# EasyEDA schematic SCH_HVACMon2_2024-07-10.json
TITLE: HVAC Monitor; REV: 2.0; Date: 2024-06-05; Sheet: 1/1; Drawn By: Chris Smith; Company: Your Company
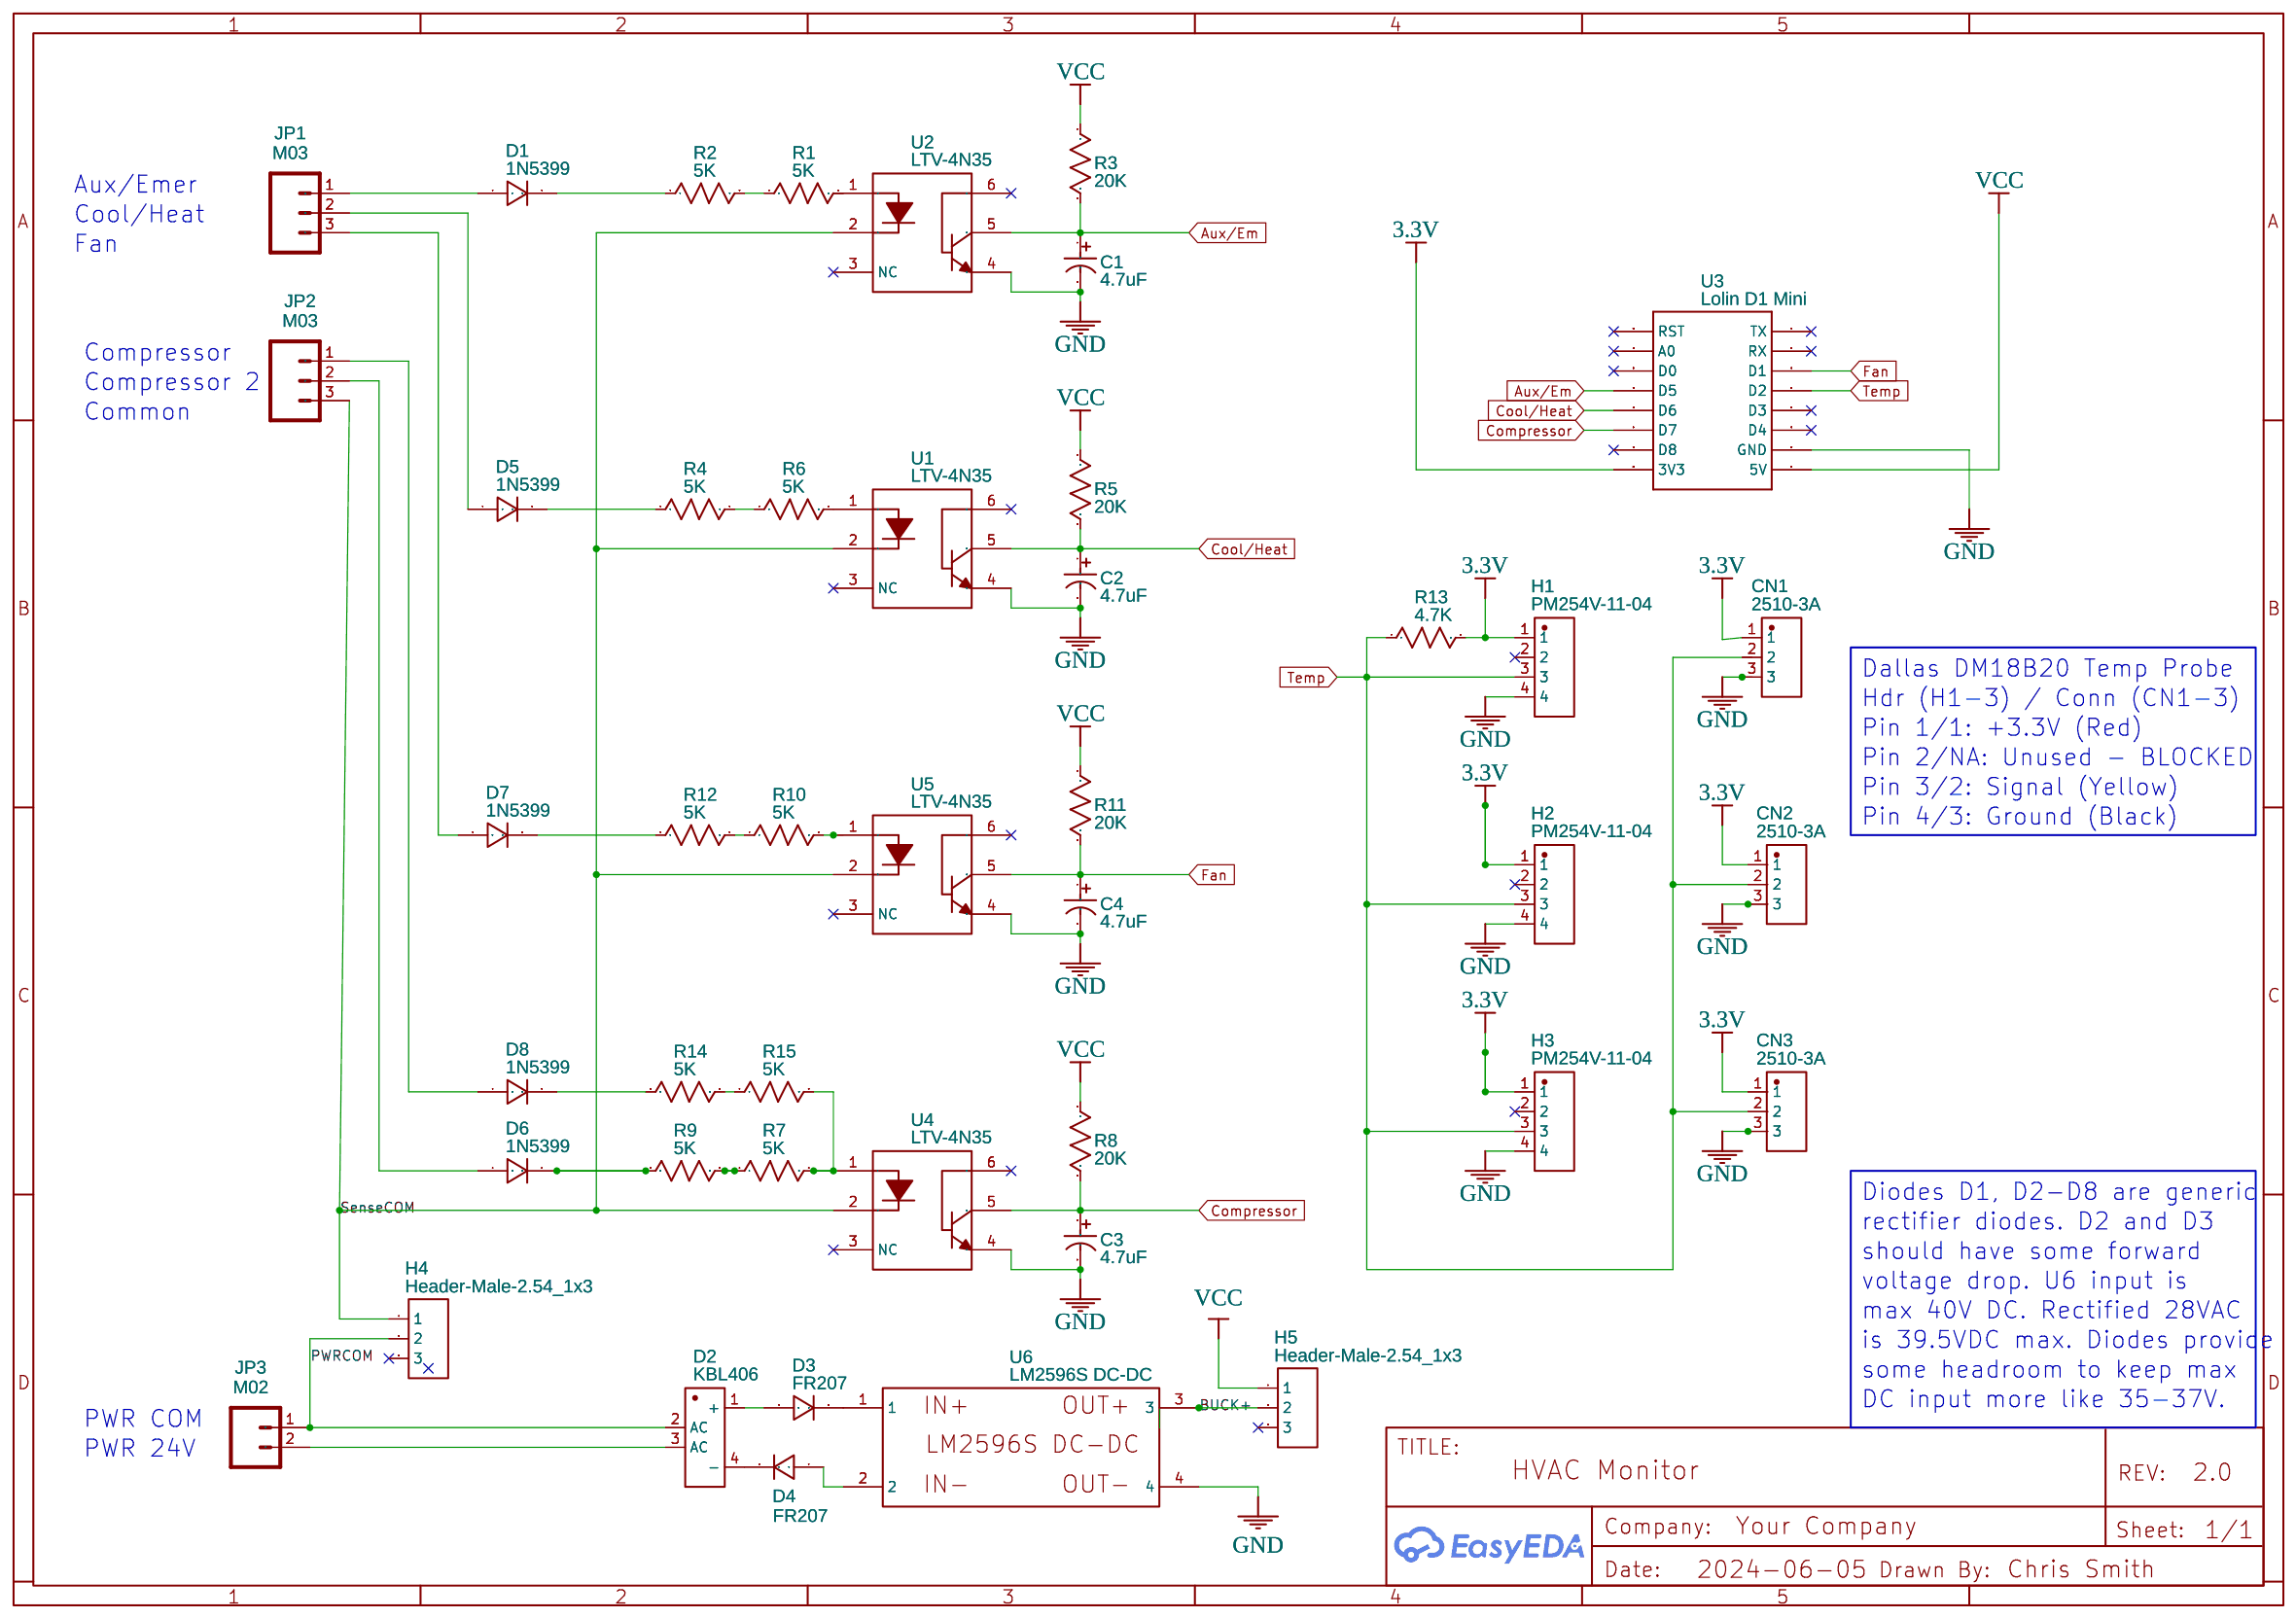
[diagram p0: schematic sheet]

## Parts
C1  4.7uF  [CAP-TH_BD4.0-P1.50-D0.8-FD]
C2  4.7uF  [CAP-TH_BD4.0-P1.50-D0.8-FD]
C3  4.7uF  [CAP-TH_BD4.0-P1.50-D0.8-FD]
C4  4.7uF  [CAP-TH_BD4.0-P1.50-D0.8-FD]
CN1  2510-3A  [CONN-TH_3P-P2.54_CAX_2510-3A]
CN2  2510-3A  [CONN-TH_3P-P2.54_CAX_2510-3A]
CN3  2510-3A  [CONN-TH_3P-P2.54_CAX_2510-3A]
D1  1N5399  [DIODE_DO41]
D2  KBL406  [DIO-BG-TH_KBL406]
D3  FR207  [DIODE_DO41]
D4  FR207  [DIODE_DO41]
D5  1N5399  [DIODE_DO41]
D6  1N5399  [DIODE_DO41]
D7  1N5399  [DIODE_DO41]
D8  1N5399  [DIODE_DO41]
H1  PM254V-11-04  [HDR-TH_4P-P2.54-V-F]
H2  PM254V-11-04  [HDR-TH_4P-P2.54-V-F]
H3  PM254V-11-04  [HDR-TH_4P-P2.54-V-F]
H4  Header-Male-2.54_1x3  [HDR-TH_3P-P2.54-V-M-1]
H5  Header-Male-2.54_1x3  [HDR-TH_3P-P2.54-V-M-1]
JP1  M03  [SCREWTERMINAL-5MM-3]
JP2  M03  [SCREWTERMINAL-5MM-3]
JP3  M02  [SCREWTERMINAL-5MM-2]
R1  5K  [R_AXIAL-0.4]
R2  5K  [R_AXIAL-0.4]
R3  20K  [R_AXIAL-0.4]
R4  5K  [R_AXIAL-0.4]
R5  20K  [R_AXIAL-0.4]
R6  5K  [R_AXIAL-0.4]
R7  5K  [R_AXIAL-0.4]
R8  20K  [R_AXIAL-0.4]
R9  5K  [R_AXIAL-0.4]
R10  5K  [R_AXIAL-0.4]
R11  20K  [R_AXIAL-0.4]
R12  5K  [R_AXIAL-0.4]
R13  4.7K  [R_AXIAL-0.4]
R14  5K  [R_AXIAL-0.4]
R15  5K  [R_AXIAL-0.4]
U1  LTV-4N35  [DIP-6_L7.3-W6.5-P2.54-LS7.6-BL]
U2  LTV-4N35  [DIP-6_L7.3-W6.5-P2.54-LS7.6-BL]
U3  Lolin D1 Mini  [LOLIN D1 MINI]
U4  LTV-4N35  [DIP-6_L7.3-W6.5-P2.54-LS7.6-BL]
U5  LTV-4N35  [DIP-6_L7.3-W6.5-P2.54-LS7.6-BL]
U6  LM2596S DC-DC  [LM2596S]

## Library data of the parts
C1-C4 = 4.7uF 50V 4*7: Supplier: LCSC; Manufacturer: CX(承兴); Manufacturer Part: KS475M050C07RR0VH2FP0; Supplier Part: C43841; JLCPCB Part Class: Extended Part
CN1-CN3 = 2510-3A: Contributor: lcsc; Supplier: LCSC; Supplier Part: C2847670; Manufacturer: CAX(创都); JLCPCB Part Class: Extended Part
D1 D4-D6 D8 = 1N4007W: Contributor: LCEDA_Lib; Package Display: No
D2 = KBL406: Supplier Part: C391521; Manufacturer: PANJIT(强茂); Manufacturer Part: KBL406_B0_10001; Contributor: Deepak020293; JLCPCB Part Class: Extended Part
D3 D7 = 1N4007W: Supplier: LCSC; Supplier Part: C328592; Manufacturer: BLUE ROCKET; Contributor: LCEDA_Lib; Package Display: No
H1-H3 = PM254V-11-04-H85: Contributor: LCSC; Supplier: LCSC; Supplier Part: C541851; Manufacturer: XFCN(兴飞); JLCPCB Part Class: Extended Part
H4 H5 = Header-Male-2.54_1x3: Supplier: LCSC; Manufacturer: BOOMELE(博穆精密); Manufacturer Part: 2.54-1*3P针; Supplier Part: C49257; JLCPCB Part Class: Extended Part
JP1 JP2 = M03: Contributor: SparkFun
JP3 = M02: Contributor: SparkFun
R1-R12 R14 R15 = R_0603_US: Contributor: LCEDA_Lib; Package Display: No
R13 = R_AXIAL-0.4_US: Contributor: LCEDA_Lib
U1 U2 U4 U5 = LTV-4N35: Contributor: LCSC; Supplier: LCSC; Supplier Part: C343878; Manufacturer: LITEON(光宝); JLCPCB Part Class: Extended Part
U3 = Lolin D1 Mini: sourceId: YemgaslDx; Contributor: Marco Cè
U6 = LM2596S DC-DC: Manufacturer Part: OZ0055; Supplier: QLOUNI; link: https://www.amazon.de/QLOUNI-LM2596-Converter-0-40V-Stromversorgung/dp/B077VW4BTY/ref=sr_1_1?__mk_de_DE=%C3%85M%C3%85%C5%BD%C3%95%C3%91&keywords=qlouni+lm2596&qid=1573110912&sr=8-1; Contributor: mrilic66

## Nets
3.3V: CN1.1 CN2.1 CN3.1 H1.1 H2.1 H3.1 R13.2 U3.3V3
GND: C1.2 C2.2 C3.2 C4.2 CN1.3 CN2.3 CN3.3 H1.4 H2.4 H3.4 U1.4 U2.4 U3.GND U4.4 U5.4 U6.4
VCC: H5.1 R3.1 R5.1 R8.1 R11.1 U3.5V
Aux/Em: C1.1 R3.2 U2.5 U3.D5
BUCK+: H5.2 U6.3
Compressor: C3.1 R8.2 U3.D7 U4.5
Cool/Heat: C2.1 R5.2 U1.5 U3.D6
Fan: C4.1 R11.2 U3.D1 U5.5
PWRCOM: D2.2(AC) H4.2 JP3.1(2)
SenseCOM: H4.1 JP2.3(1) U1.2 U2.2 U4.2 U5.2
Temp: CN1.2 CN2.2 CN3.2 H1.3 H2.3 H3.3 R13.1 U3.D2
Net-(D1-1): D1.1(2) JP1.1(3)
Net-(D1-2): D1.2(1) R2.1
Net-(D2-1): D2.1(+) D3.1(2)
Net-(D2-3): D2.3(AC) JP3.2(1)
Net-(D2-4): D2.4(-) D4.2(1)
Net-(D3-2): D3.2(1) U6.1
Net-(D4-1): D4.1(2) U6.2
Net-(D5-1): D5.1(2) JP1.2
Net-(D5-2): D5.2(1) R4.1
Net-(D6-1): D6.1(2) JP2.2
Net-(D6-2): D6.2(1) R9.1
Net-(D7-1): D7.1(2) JP1.3(1)
Net-(D7-2): D7.2(1) R12.1
Net-(D8-1): D8.1(2) JP2.1(3)
Net-(D8-2): D8.2(1) R14.1
Net-(R1-1): R1.1 R2.2
Net-(R1-2): R1.2 U2.1
Net-(R4-2): R4.2 R6.1
Net-(R6-2): R6.2 U1.1
Net-(R7-1): R7.1 R9.2
Net-(R7-2): R7.2 R15.2 U4.1
Net-(R10-1): R10.1 R12.2
Net-(R10-2): R10.2 U5.1
Net-(R14-2): R14.2 R15.1

Not connected (* = marked no-connect by the designer): H1 2*; H2 2*; H3 2*; H4 3*; H5 3*; U1 3(NC)* 6(B)*; U2 3(NC)* 6(B)*; U3 A0* D0* D3* D4* D8* RST* RX* TX*; U4 3(NC)* 6(B)*; U5 3(NC)* 6(B)*

## Notes on the sheet
- Aux/Emer
- Cool/Heat
- Fan
- Compressor
- Compressor 2
- Common
- Dallas DM18B20 Temp Probe
- Hdr (H1-3) / Conn (CN1-3)
- Pin 1/1: +3.3V (Red)
- Pin 2/NA: Unused - BLOCKED
- Pin 3/2: Signal (Yellow)
- Pin 4/3: Ground (Black)
- Diodes D1, D2-D8 are generic
- rectifier diodes. D2 and D3
- should have some forward
- voltage drop. U6 input is
- max 40V DC. Rectified 28VAC
- is 39.5VDC max. Diodes provide
- some headroom to keep max
- DC input more like 35-37V.
- PWR COM
- PWR 24V
